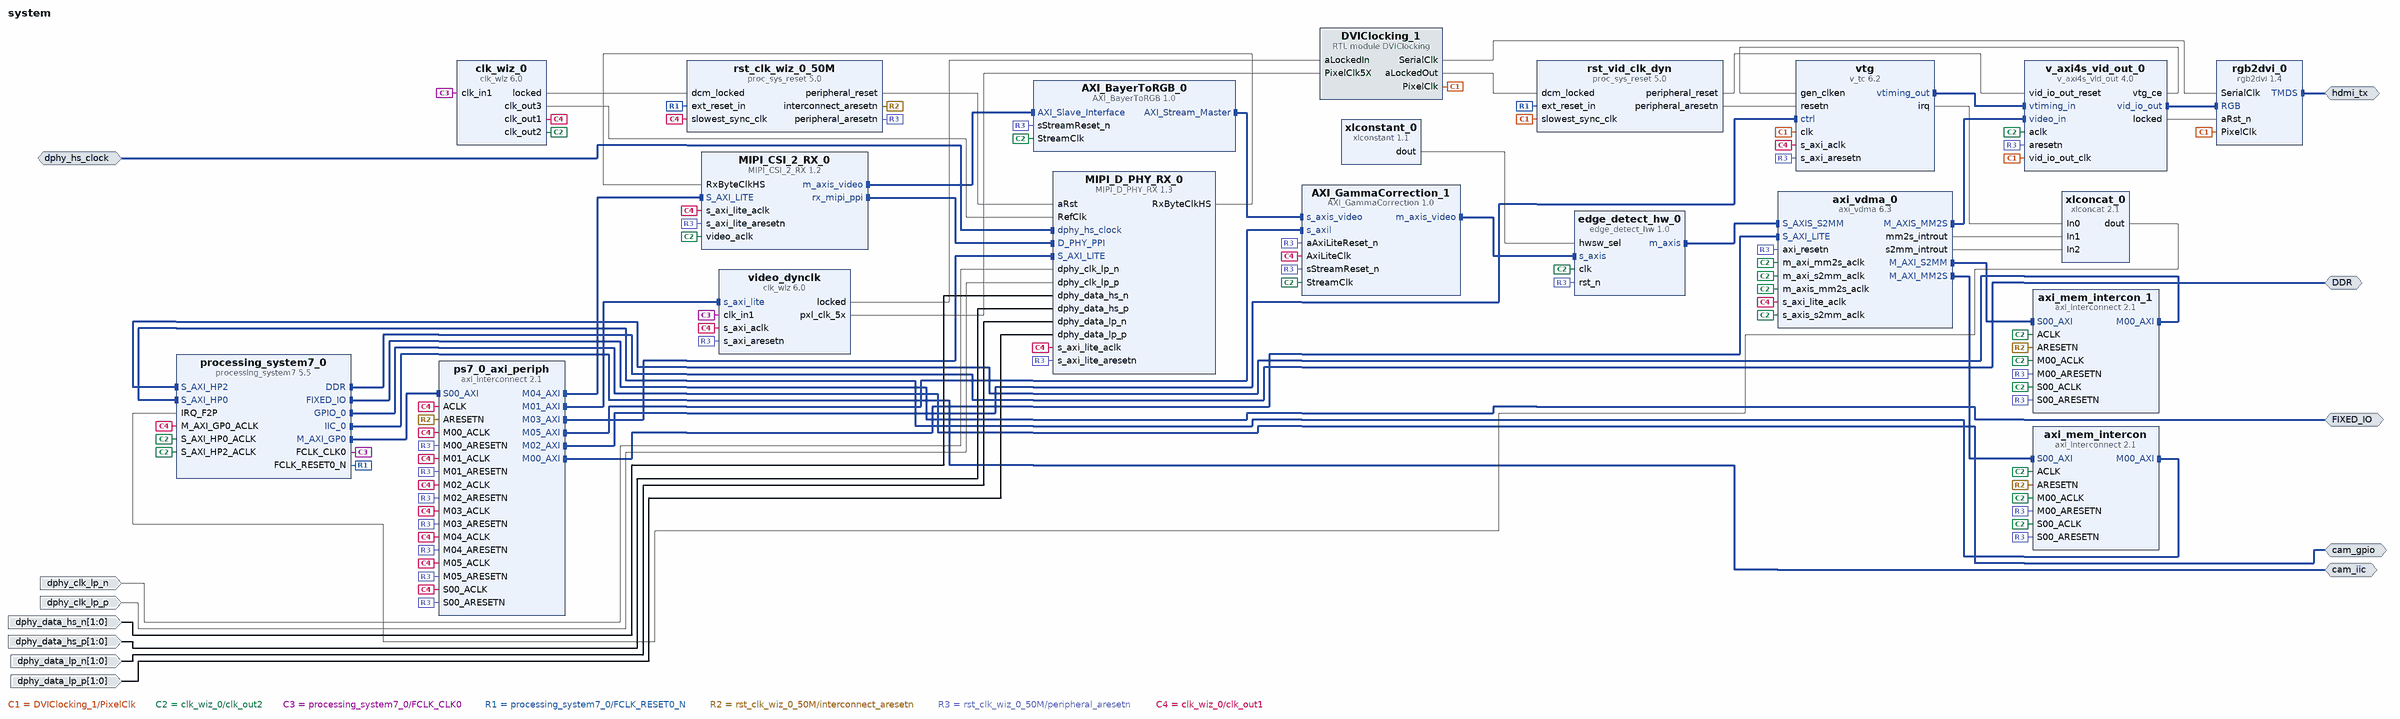
[diagram p0: block diagram of the top level]
# Vivado block design system, xc7z010clg400-1, Vivado 2023.1
create_bd_design system

create_bd_intf_port -mode Master -vlnv xilinx.com:interface:ddrx_rtl:1.0 DDR
create_bd_intf_port -mode Master -vlnv xilinx.com:display_processing_system7:fixedio_rtl:1.0 FIXED_IO
create_bd_intf_port -mode Master -vlnv xilinx.com:interface:gpio_rtl:1.0 cam_gpio
create_bd_intf_port -mode Master -vlnv xilinx.com:interface:iic_rtl:1.0 cam_iic
create_bd_intf_port -mode Slave -vlnv xilinx.com:interface:diff_clock_rtl:1.0 dphy_hs_clock
set_property -dict {CONFIG.FREQ_HZ 336000000} [get_bd_intf_ports dphy_hs_clock]
create_bd_intf_port -mode Master -vlnv digilentinc.com:interface:tmds_rtl:1.0 hdmi_tx
create_bd_port -dir I dphy_clk_lp_n
create_bd_port -dir I dphy_clk_lp_p
create_bd_port -dir I -from 1 -to 0 dphy_data_hs_n
create_bd_port -dir I -from 1 -to 0 dphy_data_hs_p
create_bd_port -dir I -from 1 -to 0 dphy_data_lp_n
create_bd_port -dir I -from 1 -to 0 dphy_data_lp_p

create_bd_cell -type ip -vlnv digilentinc.com:user:AXI_BayerToRGB:1.0 AXI_BayerToRGB_0
create_bd_cell -type ip -vlnv digilentinc.com:user:AXI_GammaCorrection:1.0 AXI_GammaCorrection_1
create_bd_cell -type ip -vlnv digilentinc.com:ip:MIPI_CSI_2_RX:1.2 MIPI_CSI_2_RX_0
set_property -dict {CONFIG.kDebug false CONFIG.kGenerateAXIL true} [get_bd_cells MIPI_CSI_2_RX_0]
create_bd_cell -type ip -vlnv digilentinc.com:ip:MIPI_D_PHY_RX:1.3 MIPI_D_PHY_RX_0
set_property -dict [list \
  CONFIG.kDebug false \
  CONFIG.kGenerateAXIL true \
  CONFIG.kLPFromLane0 false \
  CONFIG.kNoOfDataLanes 2 \
] [get_bd_cells MIPI_D_PHY_RX_0]
create_bd_cell -type ip -vlnv xilinx.com:ip:processing_system7:5.5 processing_system7_0
set_property -dict [list \
  CONFIG.PCW_ENET0_ENET0_IO {MIO 16 .. 27} \
  CONFIG.PCW_ENET0_GRP_MDIO_ENABLE 1 \
  CONFIG.PCW_ENET0_GRP_MDIO_IO {MIO 52 .. 53} \
  CONFIG.PCW_ENET0_PERIPHERAL_ENABLE 1 \
  CONFIG.PCW_ENET0_RESET_ENABLE 0 \
  CONFIG.PCW_ENET_RESET_ENABLE 1 \
  CONFIG.PCW_ENET_RESET_SELECT {Share reset pin} \
  CONFIG.PCW_FPGA0_PERIPHERAL_FREQMHZ 100 \
  CONFIG.PCW_FPGA1_PERIPHERAL_FREQMHZ 200 \
  CONFIG.PCW_FPGA2_PERIPHERAL_FREQMHZ 200 \
  CONFIG.PCW_GPIO_EMIO_GPIO_ENABLE 1 \
  CONFIG.PCW_GPIO_EMIO_GPIO_IO 1 \
  CONFIG.PCW_GPIO_EMIO_GPIO_WIDTH 1 \
  CONFIG.PCW_GPIO_MIO_GPIO_ENABLE 1 \
  CONFIG.PCW_GPIO_MIO_GPIO_IO MIO \
  CONFIG.PCW_I2C0_I2C0_IO EMIO \
  CONFIG.PCW_I2C0_PERIPHERAL_ENABLE 1 \
  CONFIG.PCW_I2C_PERIPHERAL_FREQMHZ 111.111115 \
  CONFIG.PCW_I2C_RESET_ENABLE 1 \
  CONFIG.PCW_I2C_RESET_SELECT {Share reset pin} \
  CONFIG.PCW_IRQ_F2P_INTR 1 \
  CONFIG.PCW_PRESET_BANK1_VOLTAGE {LVCMOS 1.8V} \
  CONFIG.PCW_QSPI_GRP_FBCLK_ENABLE 1 \
  CONFIG.PCW_QSPI_GRP_FBCLK_IO {MIO 8} \
  CONFIG.PCW_QSPI_GRP_SINGLE_SS_ENABLE 1 \
  CONFIG.PCW_QSPI_GRP_SINGLE_SS_IO {MIO 1 .. 6} \
  CONFIG.PCW_QSPI_PERIPHERAL_ENABLE 1 \
  CONFIG.PCW_QSPI_QSPI_IO {MIO 1 .. 6} \
  CONFIG.PCW_SD0_GRP_CD_ENABLE 1 \
  CONFIG.PCW_SD0_GRP_CD_IO EMIO \
  CONFIG.PCW_SD0_GRP_WP_ENABLE 0 \
  CONFIG.PCW_SD0_PERIPHERAL_ENABLE 1 \
  CONFIG.PCW_SD0_SD0_IO {MIO 40 .. 45} \
  CONFIG.PCW_SDIO_PERIPHERAL_FREQMHZ 100 \
  CONFIG.PCW_SINGLE_QSPI_DATA_MODE x4 \
  CONFIG.PCW_UART1_PERIPHERAL_ENABLE 1 \
  CONFIG.PCW_UART1_UART1_IO {MIO 48 .. 49} \
  CONFIG.PCW_UART_PERIPHERAL_FREQMHZ 100 \
  CONFIG.PCW_UIPARAM_DDR_PARTNO {MT41K256M16 RE-125} \
  CONFIG.PCW_USB0_PERIPHERAL_ENABLE 1 \
  CONFIG.PCW_USB0_RESET_ENABLE 1 \
  CONFIG.PCW_USB0_RESET_IO {MIO 46} \
  CONFIG.PCW_USB0_USB0_IO {MIO 28 .. 39} \
  CONFIG.PCW_USB_RESET_ENABLE 1 \
  CONFIG.PCW_USB_RESET_SELECT {Share reset pin} \
  CONFIG.PCW_USE_FABRIC_INTERRUPT 1 \
  CONFIG.PCW_USE_S_AXI_HP0 1 \
  CONFIG.PCW_USE_S_AXI_HP2 1 \
] [get_bd_cells processing_system7_0]
# 218 more settings of processing_system7_0 are not shown: defaults, MIO pin electricals, DDR timing, and values the tool derives
create_bd_cell -type ip -vlnv digilentinc.com:ip:rgb2dvi:1.4 rgb2dvi_0
set_property -dict {CONFIG.kGenerateSerialClk false CONFIG.kRstActiveHigh false} [get_bd_cells rgb2dvi_0]
create_bd_cell -type ip -vlnv xilinx.com:ip:proc_sys_reset:5.0 rst_clk_wiz_0_50M
create_bd_cell -type ip -vlnv xilinx.com:ip:proc_sys_reset:5.0 rst_vid_clk_dyn
create_bd_cell -type ip -vlnv xilinx.com:ip:xlconcat:2.1 xlconcat_0
set_property -dict {CONFIG.NUM_PORTS 3} [get_bd_cells xlconcat_0]
create_bd_cell -type ip -vlnv xilinx.com:ip:axi_interconnect:2.1 axi_mem_intercon
set_property -dict {CONFIG.NUM_MI 1 CONFIG.SYNCHRONIZATION_STAGES 2} [get_bd_cells axi_mem_intercon]
create_bd_cell -type ip -vlnv xilinx.com:ip:axi_interconnect:2.1 axi_mem_intercon_1
set_property -dict {CONFIG.NUM_MI 1 CONFIG.SYNCHRONIZATION_STAGES 2} [get_bd_cells axi_mem_intercon_1]
create_bd_cell -type ip -vlnv xilinx.com:ip:axi_vdma:6.3 axi_vdma_0
set_property -dict [list \
  CONFIG.c_include_mm2s_dre 0 \
  CONFIG.c_include_s2mm 1 \
  CONFIG.c_m_axi_s2mm_data_width 64 \
  CONFIG.c_m_axis_mm2s_tdata_width 24 \
  CONFIG.c_mm2s_linebuffer_depth 1024 \
  CONFIG.c_s2mm_genlock_mode 2 \
  CONFIG.c_s2mm_linebuffer_depth 1024 \
] [get_bd_cells axi_vdma_0]
create_bd_cell -type ip -vlnv xilinx.com:ip:clk_wiz:6.0 clk_wiz_0
set_property -dict [list \
  CONFIG.CLKOUT1_DRIVES BUFG \
  CONFIG.CLKOUT1_JITTER 174.353 \
  CONFIG.CLKOUT1_PHASE_ERROR 132.063 \
  CONFIG.CLKOUT1_REQUESTED_OUT_FREQ 50 \
  CONFIG.CLKOUT2_DRIVES BUFG \
  CONFIG.CLKOUT2_JITTER 139.594 \
  CONFIG.CLKOUT2_PHASE_ERROR 132.063 \
  CONFIG.CLKOUT2_REQUESTED_OUT_FREQ 150 \
  CONFIG.CLKOUT2_USED true \
  CONFIG.CLKOUT3_DRIVES BUFG \
  CONFIG.CLKOUT3_JITTER 132.221 \
  CONFIG.CLKOUT3_PHASE_ERROR 132.063 \
  CONFIG.CLKOUT3_REQUESTED_OUT_FREQ 200 \
  CONFIG.CLKOUT3_USED true \
  CONFIG.CLKOUT4_DRIVES BUFG \
  CONFIG.CLKOUT5_DRIVES BUFG \
  CONFIG.CLKOUT6_DRIVES BUFG \
  CONFIG.CLKOUT7_DRIVES BUFG \
  CONFIG.CLK_OUT2_PORT clk_out2 \
  CONFIG.CLK_OUT3_PORT clk_out3 \
  CONFIG.MMCM_CLKFBOUT_MULT_F 6.000 \
  CONFIG.MMCM_CLKIN1_PERIOD 10.0 \
  CONFIG.MMCM_CLKIN2_PERIOD 10.0 \
  CONFIG.MMCM_CLKOUT0_DIVIDE_F 12.000 \
  CONFIG.MMCM_CLKOUT1_DIVIDE 4 \
  CONFIG.MMCM_CLKOUT2_DIVIDE 3 \
  CONFIG.MMCM_DIVCLK_DIVIDE 1 \
  CONFIG.NUM_OUT_CLKS 3 \
  CONFIG.PRIM_SOURCE Global_buffer \
  CONFIG.RESET_PORT reset \
  CONFIG.RESET_TYPE ACTIVE_HIGH \
  CONFIG.SECONDARY_SOURCE Single_ended_clock_capable_pin \
  CONFIG.USE_PHASE_ALIGNMENT true \
  CONFIG.USE_RESET false \
] [get_bd_cells clk_wiz_0]
create_bd_cell -type ip -vlnv xilinx.com:ip:axi_interconnect:2.1 ps7_0_axi_periph
set_property -dict {CONFIG.NUM_MI 6 CONFIG.SYNCHRONIZATION_STAGES 2} [get_bd_cells ps7_0_axi_periph]
create_bd_cell -type ip -vlnv xilinx.com:ip:v_axi4s_vid_out:4.0 v_axi4s_vid_out_0
set_property -dict {CONFIG.C_HAS_ASYNC_CLK 1 CONFIG.C_VTG_MASTER_SLAVE 1} [get_bd_cells v_axi4s_vid_out_0]
create_bd_cell -type ip -vlnv xilinx.com:ip:clk_wiz:6.0 video_dynclk
set_property -dict [list \
  CONFIG.CLKOUT1_DRIVES No_buffer \
  CONFIG.CLKOUT1_JITTER 232.529 \
  CONFIG.CLKOUT1_PHASE_ERROR 322.999 \
  CONFIG.CLKOUT1_REQUESTED_OUT_FREQ 742.5 \
  CONFIG.CLKOUT2_DRIVES BUFG \
  CONFIG.CLKOUT3_DRIVES BUFG \
  CONFIG.CLKOUT4_DRIVES BUFG \
  CONFIG.CLKOUT5_DRIVES BUFG \
  CONFIG.CLKOUT6_DRIVES BUFG \
  CONFIG.CLKOUT7_DRIVES BUFG \
  CONFIG.CLK_OUT1_PORT pxl_clk_5x \
  CONFIG.FEEDBACK_SOURCE FDBK_ONCHIP \
  CONFIG.MMCM_CLKFBOUT_MULT_F 37.125 \
  CONFIG.MMCM_CLKIN1_PERIOD 10.000 \
  CONFIG.MMCM_CLKIN2_PERIOD 10.000 \
  CONFIG.MMCM_CLKOUT0_DIVIDE_F 1.000 \
  CONFIG.MMCM_DIVCLK_DIVIDE 5 \
  CONFIG.PRIM_SOURCE No_buffer \
  CONFIG.SECONDARY_SOURCE Single_ended_clock_capable_pin \
  CONFIG.USE_DYN_RECONFIG true \
  CONFIG.USE_FREQ_SYNTH true \
  CONFIG.USE_PHASE_ALIGNMENT false \
] [get_bd_cells video_dynclk]
create_bd_cell -type ip -vlnv xilinx.com:ip:v_tc:6.2 vtg
set_property -dict {CONFIG.VIDEO_MODE 720p CONFIG.enable_detection false} [get_bd_cells vtg]
create_bd_cell -type module -reference DVIClocking DVIClocking_1
create_bd_cell -type ip -vlnv xilinx.com:ip:xlconstant:1.1 xlconstant_0
create_bd_cell -type ip -vlnv Arm.com:user:edge_detect_hw:1.0 edge_detect_hw_0

# ---- connections ----

connect_bd_intf_net [get_bd_intf_pins AXI_BayerToRGB_0/AXI_Stream_Master] [get_bd_intf_pins AXI_GammaCorrection_1/s_axis_video]
connect_bd_intf_net [get_bd_intf_pins AXI_GammaCorrection_1/m_axis_video] [get_bd_intf_pins edge_detect_hw_0/s_axis]
connect_bd_intf_net [get_bd_intf_pins AXI_BayerToRGB_0/AXI_Slave_Interface] [get_bd_intf_pins MIPI_CSI_2_RX_0/m_axis_video]
connect_bd_intf_net [get_bd_intf_pins MIPI_CSI_2_RX_0/rx_mipi_ppi] [get_bd_intf_pins MIPI_D_PHY_RX_0/D_PHY_PPI]
connect_bd_intf_net [get_bd_intf_pins axi_mem_intercon_1/M00_AXI] [get_bd_intf_pins processing_system7_0/S_AXI_HP2]
connect_bd_intf_net [get_bd_intf_pins axi_mem_intercon/M00_AXI] [get_bd_intf_pins processing_system7_0/S_AXI_HP0]
connect_bd_intf_net [get_bd_intf_pins axi_vdma_0/M_AXIS_MM2S] [get_bd_intf_pins v_axi4s_vid_out_0/video_in]
connect_bd_intf_net [get_bd_intf_pins axi_mem_intercon/S00_AXI] [get_bd_intf_pins axi_vdma_0/M_AXI_MM2S]
connect_bd_intf_net [get_bd_intf_pins axi_mem_intercon_1/S00_AXI] [get_bd_intf_pins axi_vdma_0/M_AXI_S2MM]
connect_bd_intf_net [get_bd_intf_ports dphy_hs_clock] [get_bd_intf_pins MIPI_D_PHY_RX_0/dphy_hs_clock]
connect_bd_intf_net [get_bd_intf_pins edge_detect_hw_0/m_axis] [get_bd_intf_pins axi_vdma_0/S_AXIS_S2MM]
connect_bd_intf_net [get_bd_intf_ports DDR] [get_bd_intf_pins processing_system7_0/DDR]
connect_bd_intf_net [get_bd_intf_ports FIXED_IO] [get_bd_intf_pins processing_system7_0/FIXED_IO]
connect_bd_intf_net [get_bd_intf_ports cam_gpio] [get_bd_intf_pins processing_system7_0/GPIO_0]
connect_bd_intf_net [get_bd_intf_ports cam_iic] [get_bd_intf_pins processing_system7_0/IIC_0]
connect_bd_intf_net [get_bd_intf_pins processing_system7_0/M_AXI_GP0] [get_bd_intf_pins ps7_0_axi_periph/S00_AXI]
connect_bd_intf_net [get_bd_intf_pins axi_vdma_0/S_AXI_LITE] [get_bd_intf_pins ps7_0_axi_periph/M00_AXI]
connect_bd_intf_net [get_bd_intf_pins ps7_0_axi_periph/M01_AXI] [get_bd_intf_pins video_dynclk/s_axi_lite]
connect_bd_intf_net [get_bd_intf_pins ps7_0_axi_periph/M02_AXI] [get_bd_intf_pins vtg/ctrl]
connect_bd_intf_net [get_bd_intf_pins MIPI_D_PHY_RX_0/S_AXI_LITE] [get_bd_intf_pins ps7_0_axi_periph/M03_AXI]
connect_bd_intf_net [get_bd_intf_pins MIPI_CSI_2_RX_0/S_AXI_LITE] [get_bd_intf_pins ps7_0_axi_periph/M04_AXI]
connect_bd_intf_net [get_bd_intf_pins AXI_GammaCorrection_1/s_axil] [get_bd_intf_pins ps7_0_axi_periph/M05_AXI]
connect_bd_intf_net [get_bd_intf_ports hdmi_tx] [get_bd_intf_pins rgb2dvi_0/TMDS]
connect_bd_intf_net [get_bd_intf_pins rgb2dvi_0/RGB] [get_bd_intf_pins v_axi4s_vid_out_0/vid_io_out]
connect_bd_intf_net -intf_net v_tc_0_vtiming_out [get_bd_intf_pins v_axi4s_vid_out_0/vtiming_in] [get_bd_intf_pins vtg/vtiming_out]
connect_bd_net [get_bd_pins DVIClocking_1/SerialClk] [get_bd_pins rgb2dvi_0/SerialClk]
connect_bd_net [get_bd_pins DVIClocking_1/aLockedOut] [get_bd_pins rst_vid_clk_dyn/dcm_locked]
connect_bd_net [get_bd_pins MIPI_D_PHY_RX_0/RxByteClkHS] [get_bd_pins MIPI_CSI_2_RX_0/RxByteClkHS]
connect_bd_net -net PixelClk_Generator_clk_out1 [get_bd_pins DVIClocking_1/PixelClk] \
  [get_bd_pins rgb2dvi_0/PixelClk] [get_bd_pins rst_vid_clk_dyn/slowest_sync_clk] \
  [get_bd_pins v_axi4s_vid_out_0/vid_io_out_clk] [get_bd_pins vtg/clk]
connect_bd_net [get_bd_pins axi_vdma_0/mm2s_introut] [get_bd_pins xlconcat_0/In1]
connect_bd_net [get_bd_pins axi_vdma_0/s2mm_introut] [get_bd_pins xlconcat_0/In2]
connect_bd_net [get_bd_pins clk_wiz_0/locked] [get_bd_pins rst_clk_wiz_0_50M/dcm_locked]
connect_bd_net [get_bd_ports dphy_clk_lp_n] [get_bd_pins MIPI_D_PHY_RX_0/dphy_clk_lp_n]
connect_bd_net [get_bd_ports dphy_clk_lp_p] [get_bd_pins MIPI_D_PHY_RX_0/dphy_clk_lp_p]
connect_bd_net [get_bd_ports dphy_data_hs_n] [get_bd_pins MIPI_D_PHY_RX_0/dphy_data_hs_n]
connect_bd_net [get_bd_ports dphy_data_hs_p] [get_bd_pins MIPI_D_PHY_RX_0/dphy_data_hs_p]
connect_bd_net [get_bd_ports dphy_data_lp_n] [get_bd_pins MIPI_D_PHY_RX_0/dphy_data_lp_n]
connect_bd_net [get_bd_ports dphy_data_lp_p] [get_bd_pins MIPI_D_PHY_RX_0/dphy_data_lp_p]
connect_bd_net -net mm_clk_150 [get_bd_pins clk_wiz_0/clk_out2] \
  [get_bd_pins AXI_BayerToRGB_0/StreamClk] [get_bd_pins AXI_GammaCorrection_1/StreamClk] \
  [get_bd_pins MIPI_CSI_2_RX_0/video_aclk] [get_bd_pins processing_system7_0/S_AXI_HP0_ACLK] \
  [get_bd_pins processing_system7_0/S_AXI_HP2_ACLK] [get_bd_pins axi_mem_intercon/ACLK] \
  [get_bd_pins axi_mem_intercon/S00_ACLK] [get_bd_pins axi_mem_intercon/M00_ACLK] [get_bd_pins axi_mem_intercon_1/ACLK] \
  [get_bd_pins axi_mem_intercon_1/S00_ACLK] [get_bd_pins axi_mem_intercon_1/M00_ACLK] \
  [get_bd_pins axi_vdma_0/m_axi_mm2s_aclk] [get_bd_pins axi_vdma_0/m_axis_mm2s_aclk] [get_bd_pins axi_vdma_0/m_axi_s2mm_aclk] \
  [get_bd_pins axi_vdma_0/s_axis_s2mm_aclk] [get_bd_pins v_axi4s_vid_out_0/aclk] [get_bd_pins edge_detect_hw_0/clk]
connect_bd_net [get_bd_pins processing_system7_0/FCLK_CLK0] [get_bd_pins clk_wiz_0/clk_in1] [get_bd_pins video_dynclk/clk_in1]
connect_bd_net [get_bd_pins processing_system7_0/FCLK_RESET0_N] \
  [get_bd_pins rst_clk_wiz_0_50M/ext_reset_in] [get_bd_pins rst_vid_clk_dyn/ext_reset_in]
connect_bd_net -net ref_clk_200 [get_bd_pins clk_wiz_0/clk_out3] [get_bd_pins MIPI_D_PHY_RX_0/RefClk]
connect_bd_net [get_bd_pins rst_clk_wiz_0_50M/interconnect_aresetn] \
  [get_bd_pins axi_mem_intercon/ARESETN] [get_bd_pins axi_mem_intercon_1/ARESETN] [get_bd_pins ps7_0_axi_periph/ARESETN]
connect_bd_net [get_bd_pins rst_clk_wiz_0_50M/peripheral_aresetn] \
  [get_bd_pins AXI_BayerToRGB_0/sStreamReset_n] [get_bd_pins AXI_GammaCorrection_1/aAxiLiteReset_n] \
  [get_bd_pins AXI_GammaCorrection_1/sStreamReset_n] [get_bd_pins MIPI_CSI_2_RX_0/s_axi_lite_aresetn] \
  [get_bd_pins MIPI_D_PHY_RX_0/s_axi_lite_aresetn] [get_bd_pins axi_mem_intercon/S00_ARESETN] \
  [get_bd_pins axi_mem_intercon/M00_ARESETN] [get_bd_pins axi_mem_intercon_1/S00_ARESETN] \
  [get_bd_pins axi_mem_intercon_1/M00_ARESETN] [get_bd_pins axi_vdma_0/axi_resetn] [get_bd_pins ps7_0_axi_periph/S00_ARESETN] \
  [get_bd_pins ps7_0_axi_periph/M00_ARESETN] [get_bd_pins ps7_0_axi_periph/M01_ARESETN] \
  [get_bd_pins ps7_0_axi_periph/M02_ARESETN] [get_bd_pins ps7_0_axi_periph/M03_ARESETN] \
  [get_bd_pins ps7_0_axi_periph/M04_ARESETN] [get_bd_pins ps7_0_axi_periph/M05_ARESETN] \
  [get_bd_pins v_axi4s_vid_out_0/aresetn] [get_bd_pins video_dynclk/s_axi_aresetn] [get_bd_pins vtg/s_axi_aresetn] \
  [get_bd_pins edge_detect_hw_0/rst_n]
connect_bd_net [get_bd_pins rst_clk_wiz_0_50M/peripheral_reset] [get_bd_pins MIPI_D_PHY_RX_0/aRst]
connect_bd_net [get_bd_pins rst_vid_clk_dyn/peripheral_aresetn] [get_bd_pins vtg/resetn]
connect_bd_net [get_bd_pins rst_vid_clk_dyn/peripheral_reset] [get_bd_pins v_axi4s_vid_out_0/vid_io_out_reset]
connect_bd_net -net s_axil_clk_50 [get_bd_pins clk_wiz_0/clk_out1] \
  [get_bd_pins AXI_GammaCorrection_1/AxiLiteClk] [get_bd_pins MIPI_CSI_2_RX_0/s_axi_lite_aclk] \
  [get_bd_pins MIPI_D_PHY_RX_0/s_axi_lite_aclk] [get_bd_pins processing_system7_0/M_AXI_GP0_ACLK] \
  [get_bd_pins rst_clk_wiz_0_50M/slowest_sync_clk] [get_bd_pins axi_vdma_0/s_axi_lite_aclk] \
  [get_bd_pins ps7_0_axi_periph/ACLK] [get_bd_pins ps7_0_axi_periph/S00_ACLK] [get_bd_pins ps7_0_axi_periph/M00_ACLK] \
  [get_bd_pins ps7_0_axi_periph/M01_ACLK] [get_bd_pins ps7_0_axi_periph/M02_ACLK] [get_bd_pins ps7_0_axi_periph/M03_ACLK] \
  [get_bd_pins ps7_0_axi_periph/M04_ACLK] [get_bd_pins ps7_0_axi_periph/M05_ACLK] [get_bd_pins video_dynclk/s_axi_aclk] \
  [get_bd_pins vtg/s_axi_aclk]
connect_bd_net [get_bd_pins v_axi4s_vid_out_0/locked] [get_bd_pins rgb2dvi_0/aRst_n]
connect_bd_net [get_bd_pins v_axi4s_vid_out_0/vtg_ce] [get_bd_pins vtg/gen_clken]
connect_bd_net -net v_tc_0_irq [get_bd_pins vtg/irq] [get_bd_pins xlconcat_0/In0]
connect_bd_net [get_bd_pins video_dynclk/locked] [get_bd_pins DVIClocking_1/aLockedIn]
connect_bd_net [get_bd_pins video_dynclk/pxl_clk_5x] [get_bd_pins DVIClocking_1/PixelClk5X]
connect_bd_net [get_bd_pins xlconcat_0/dout] [get_bd_pins processing_system7_0/IRQ_F2P]
connect_bd_net [get_bd_pins xlconstant_0/dout] [get_bd_pins edge_detect_hw_0/hwsw_sel]

# ---- address map ----
assign_bd_address -offset 0x00000000 -range 1G -target_address_space [get_bd_addr_spaces axi_vdma_0/Data_MM2S] [get_bd_addr_segs processing_system7_0/S_AXI_HP0/HP0_DDR_LOWOCM]
assign_bd_address -offset 0x00000000 -range 1G -target_address_space [get_bd_addr_spaces axi_vdma_0/Data_S2MM] [get_bd_addr_segs processing_system7_0/S_AXI_HP2/HP2_DDR_LOWOCM]
assign_bd_address -offset 0x43000000 -range 64K -target_address_space [get_bd_addr_spaces processing_system7_0/Data] [get_bd_addr_segs axi_vdma_0/S_AXI_LITE/Reg]
assign_bd_address -offset 0x43C00000 -range 64K -target_address_space [get_bd_addr_spaces processing_system7_0/Data] [get_bd_addr_segs vtg/ctrl/Reg]
assign_bd_address -offset 0x43C10000 -range 64K -target_address_space [get_bd_addr_spaces processing_system7_0/Data] [get_bd_addr_segs AXI_GammaCorrection_1/s_axil/reg0]
assign_bd_address -offset 0x43C20000 -range 64K -target_address_space [get_bd_addr_spaces processing_system7_0/Data] [get_bd_addr_segs MIPI_CSI_2_RX_0/S_AXI_LITE/S_AXI_LITE_reg]
assign_bd_address -offset 0x43C30000 -range 64K -target_address_space [get_bd_addr_spaces processing_system7_0/Data] [get_bd_addr_segs MIPI_D_PHY_RX_0/S_AXI_LITE/S_AXI_LITE_reg]
assign_bd_address -offset 0x43C40000 -range 64K -target_address_space [get_bd_addr_spaces processing_system7_0/Data] [get_bd_addr_segs video_dynclk/s_axi_lite/Reg]

validate_bd_design
save_bd_design
